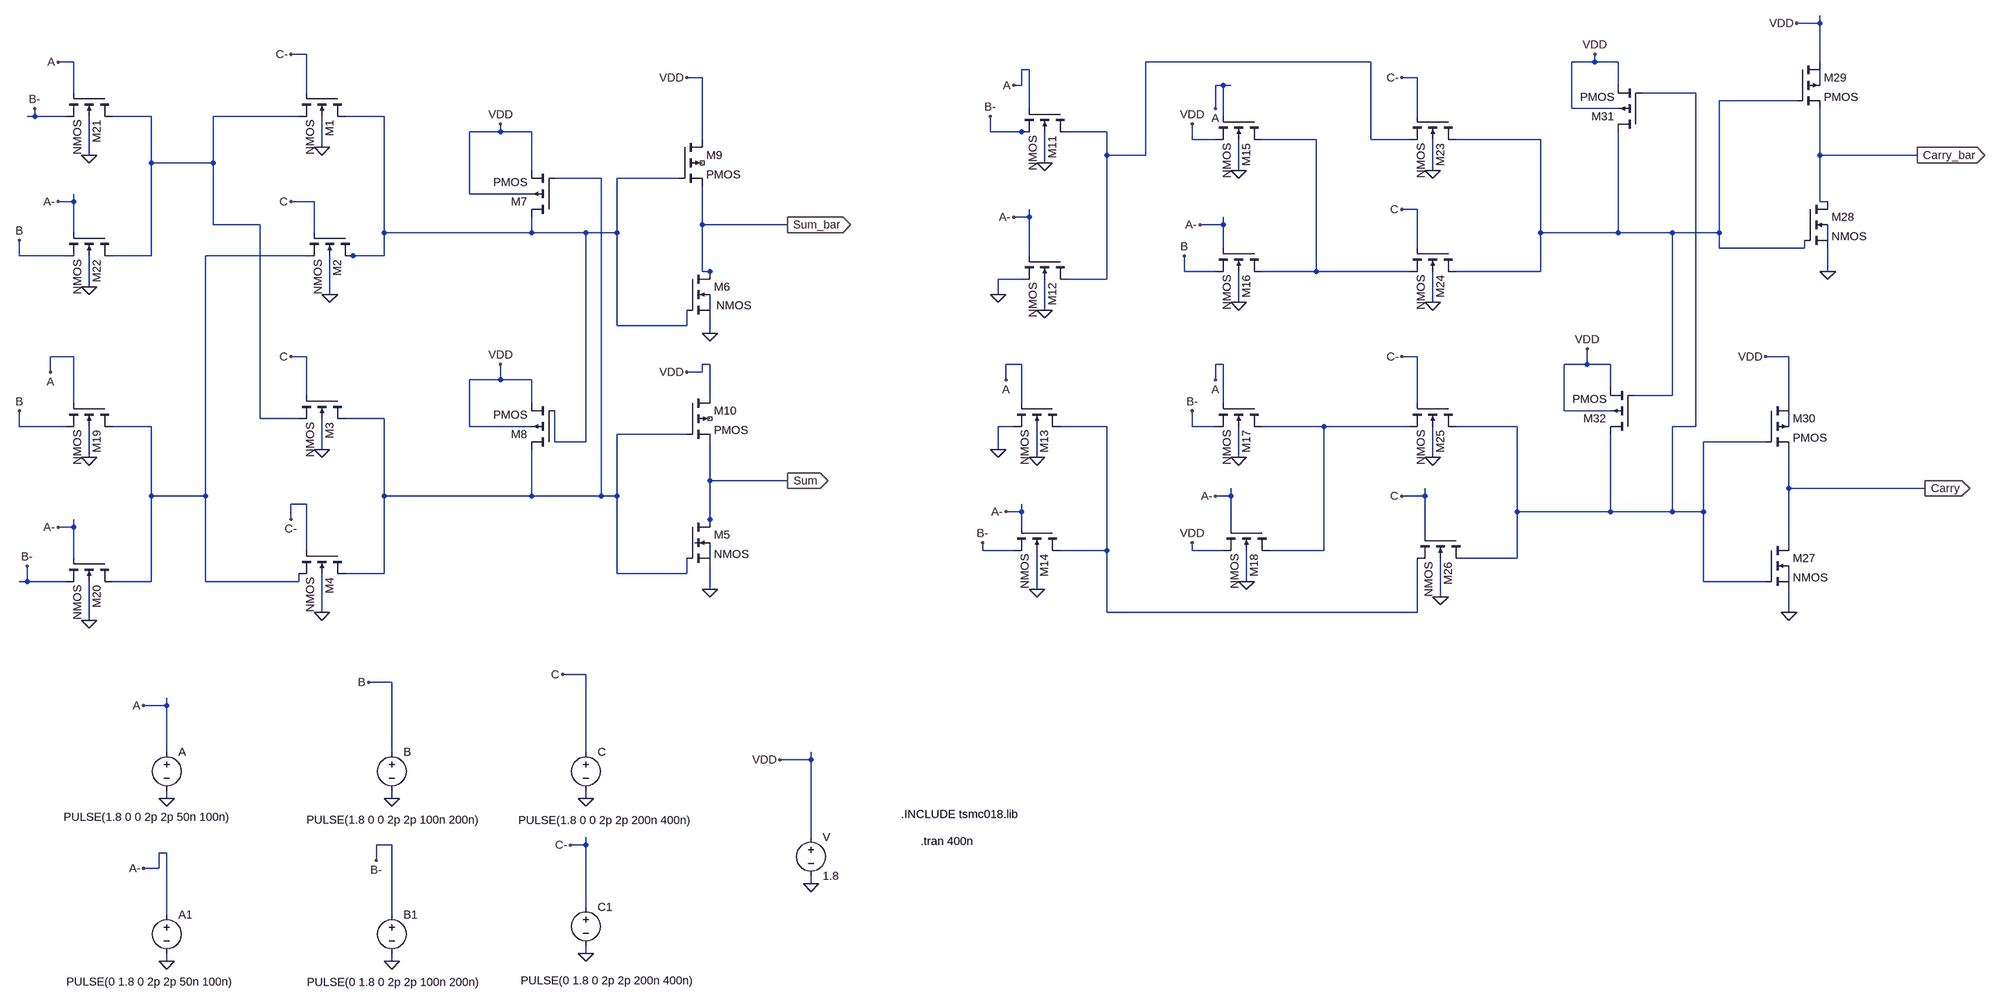
[diagram p0: schematic Pass_Transistor.asc]
Pass_Transistor.asc, the LTspice schematic file:
Version 4.1
SHEET 1 3968 1644
WIRE 3488 -352 3488 -368
WIRE 3488 -352 3440 -352
WIRE 16 -288 -16 -288
WIRE -464 -272 -496 -272
WIRE 2560 -272 2096 -272
WIRE 3024 -272 3024 -288
WIRE 3024 -272 2976 -272
WIRE 3072 -272 3024 -272
WIRE 3488 -272 3488 -352
WIRE 1856 -256 1840 -256
WIRE 832 -240 800 -240
WIRE 2656 -240 2624 -240
WIRE 1840 -224 1840 -256
WIRE 1840 -224 1824 -224
WIRE 2256 -224 2240 -224
WIRE 2272 -224 2256 -224
WIRE 3072 -224 3072 -272
WIRE 3488 -224 3488 -256
WIRE -464 -208 -464 -272
WIRE 16 -208 16 -288
WIRE 3232 -208 3120 -208
WIRE 3440 -192 3280 -192
WIRE 1856 -176 1856 -256
WIRE 2240 -176 2240 -224
WIRE 2976 -176 2976 -272
WIRE 3072 -176 2976 -176
WIRE -544 -160 -544 -176
WIRE -544 -160 -560 -160
WIRE -480 -160 -544 -160
WIRE -304 -160 -384 -160
WIRE 0 -160 -176 -160
WIRE 176 -160 96 -160
WIRE 2256 -160 2256 -224
WIRE 2656 -160 2656 -240
WIRE 416 -128 416 -144
WIRE 416 -128 352 -128
WIRE 480 -128 416 -128
WIRE 1776 -128 1776 -160
WIRE 1840 -128 1776 -128
WIRE 1856 -128 1840 -128
WIRE 2016 -128 1936 -128
WIRE 832 -112 832 -240
WIRE 2192 -112 2192 -144
WIRE 2240 -112 2192 -112
WIRE 2448 -112 2336 -112
WIRE 2560 -112 2560 -272
WIRE 2640 -112 2560 -112
WIRE 2912 -112 2736 -112
WIRE 48 -96 48 -160
WIRE -432 -80 -432 -160
WIRE 2016 -80 2016 -128
WIRE 2096 -80 2096 -272
WIRE 2096 -80 2016 -80
WIRE 3488 -80 3488 -176
WIRE 3792 -80 3488 -80
WIRE -304 -64 -304 -160
WIRE -176 -64 -176 -160
WIRE -176 -64 -304 -64
WIRE 1888 -64 1888 -128
WIRE 480 -48 480 -128
WIRE 2288 -48 2288 -112
WIRE 2688 -48 2688 -112
WIRE 624 -32 528 -32
WIRE 784 -32 656 -32
WIRE 352 0 352 -128
WIRE 480 0 352 0
WIRE -464 16 -464 0
WIRE -464 16 -496 16
WIRE 32 16 -16 16
WIRE 3488 16 3488 -80
WIRE 3504 16 3488 16
WIRE 2656 32 2624 32
WIRE 1856 48 1856 32
WIRE 1856 48 1824 48
WIRE -176 64 -176 -64
WIRE -80 64 -176 64
WIRE 832 64 832 -16
WIRE 1008 64 832 64
WIRE 2256 64 2256 48
WIRE 2256 64 2208 64
WIRE -464 80 -464 16
WIRE 32 80 32 16
WIRE 176 80 176 -160
WIRE 480 80 480 48
WIRE 480 80 176 80
WIRE 592 80 480 80
WIRE 656 80 656 -32
WIRE 656 80 592 80
WIRE 2912 80 2912 -112
WIRE 3072 80 3072 -128
WIRE 3072 80 2912 80
WIRE 3184 80 3072 80
WIRE 3280 80 3280 -192
WIRE 3280 80 3184 80
WIRE 3504 96 3504 64
WIRE 2256 112 2256 64
WIRE 2656 112 2656 32
WIRE 3280 112 3280 80
WIRE 3456 112 3456 96
WIRE 3456 112 3280 112
WIRE -576 128 -576 96
WIRE -480 128 -576 128
WIRE -304 128 -304 -64
WIRE -304 128 -384 128
WIRE 16 128 -192 128
WIRE 112 128 96 128
WIRE 176 128 176 80
WIRE 176 128 112 128
WIRE 1856 128 1856 48
WIRE 832 160 832 64
WIRE 848 160 832 160
WIRE 2176 160 2176 128
WIRE 2240 160 2176 160
WIRE 2448 160 2448 -112
WIRE 2448 160 2336 160
WIRE 2640 160 2448 160
WIRE 2912 160 2912 80
WIRE 2912 160 2736 160
WIRE 3504 160 3504 112
WIRE 848 176 848 160
WIRE 1840 176 1792 176
WIRE 2016 176 2016 -80
WIRE 2016 176 1936 176
WIRE -432 192 -432 128
WIRE 64 208 64 128
WIRE 1792 208 1792 176
WIRE 2288 224 2288 160
WIRE 2688 224 2688 160
WIRE 848 240 848 208
WIRE 1888 240 1888 176
WIRE 656 272 656 80
WIRE 800 272 800 240
WIRE 800 272 656 272
WIRE 848 288 848 256
WIRE -464 336 -512 336
WIRE 16 336 -16 336
WIRE 2656 336 2624 336
WIRE 3424 336 3376 336
WIRE 848 352 832 352
WIRE 1840 352 1808 352
WIRE 2256 352 2240 352
WIRE 3008 352 3008 320
WIRE 3008 352 2960 352
WIRE 3056 352 3008 352
WIRE -512 368 -512 336
WIRE 832 368 832 352
WIRE 832 368 800 368
WIRE 416 384 416 352
WIRE 416 384 352 384
WIRE 480 384 416 384
WIRE 1808 384 1808 352
WIRE 2240 384 2240 352
WIRE 3056 400 3056 352
WIRE 16 416 16 336
WIRE 848 416 848 352
WIRE 3184 416 3184 80
WIRE 3184 416 3104 416
WIRE -464 432 -464 336
WIRE 480 432 480 384
WIRE 1840 432 1840 352
WIRE 2256 432 2256 352
WIRE 2656 432 2656 336
WIRE 3424 432 3424 336
WIRE 2960 448 2960 352
WIRE 3056 448 2960 448
WIRE -80 464 -80 64
WIRE 0 464 -80 464
WIRE 176 464 96 464
WIRE -576 480 -576 448
WIRE -480 480 -576 480
WIRE -304 480 -384 480
WIRE 352 480 352 384
WIRE 480 480 352 480
WIRE 1824 480 1792 480
WIRE 2016 480 1920 480
WIRE 2192 480 2192 448
WIRE 2240 480 2192 480
WIRE 2464 480 2336 480
WIRE 2640 480 2464 480
WIRE 2864 480 2736 480
WIRE 3232 480 3232 -208
WIRE 3232 480 3184 480
WIRE 3424 480 3424 448
WIRE 800 496 656 496
WIRE 528 512 528 448
WIRE 592 512 592 80
WIRE 592 512 528 512
WIRE 3376 512 3248 512
WIRE 48 528 48 464
WIRE 1792 528 1792 480
WIRE -432 544 -432 480
WIRE 1872 544 1872 480
WIRE 2288 544 2288 480
WIRE 2688 544 2688 480
WIRE 848 592 848 512
WIRE 1008 592 848 592
WIRE 3424 608 3424 528
WIRE 3808 608 3424 608
WIRE -304 624 -304 480
WIRE -192 624 -192 128
WIRE -192 624 -304 624
WIRE 176 624 176 464
WIRE 480 624 480 528
WIRE 480 624 176 624
WIRE 624 624 624 -32
WIRE 624 624 480 624
WIRE 656 624 656 496
WIRE 656 624 624 624
WIRE 2272 624 2272 608
WIRE 2272 624 2240 624
WIRE 2672 624 2672 608
WIRE 2672 624 2624 624
WIRE 16 640 -16 640
WIRE 1840 656 1840 640
WIRE 1840 656 1808 656
WIRE 2864 656 2864 480
WIRE 3056 656 3056 496
WIRE 3056 656 2864 656
WIRE 3184 656 3184 480
WIRE 3184 656 3056 656
WIRE 3248 656 3248 512
WIRE 3248 656 3184 656
WIRE -16 672 -16 640
WIRE 848 672 848 592
WIRE -464 688 -464 672
WIRE -464 688 -496 688
WIRE 848 688 848 672
WIRE 1840 688 1840 656
WIRE 2272 688 2272 624
WIRE 2672 704 2672 624
WIRE 832 720 816 720
WIRE 3424 720 3424 608
WIRE 16 736 16 640
WIRE 1760 736 1760 720
WIRE 1824 736 1760 736
WIRE 2016 736 2016 480
WIRE 2016 736 1920 736
WIRE 2192 736 2192 720
WIRE 2256 736 2192 736
WIRE 2464 736 2464 480
WIRE 2464 736 2352 736
WIRE -464 752 -464 688
WIRE 848 752 848 720
WIRE 2864 752 2864 656
WIRE 2864 752 2752 752
WIRE 176 784 176 624
WIRE 176 784 96 784
WIRE 656 784 656 624
WIRE 800 784 800 752
WIRE 800 784 656 784
WIRE -560 800 -560 768
WIRE -560 800 -576 800
WIRE -480 800 -560 800
WIRE -304 800 -304 624
WIRE -304 800 -384 800
WIRE -192 800 -192 624
WIRE 0 800 0 784
WIRE 0 800 -192 800
WIRE 2304 800 2304 736
WIRE 3248 800 3248 656
WIRE 3376 800 3248 800
WIRE 3424 800 3424 768
WIRE 848 816 848 768
WIRE 1872 816 1872 736
WIRE 2704 832 2704 752
WIRE 48 864 48 784
WIRE 2016 864 2016 736
WIRE 2656 864 2656 752
WIRE 2656 864 2016 864
WIRE 3424 864 3424 816
WIRE -432 880 -432 800
WIRE 592 992 544 992
WIRE 192 1008 144 1008
WIRE -272 1056 -272 1040
WIRE -272 1056 -320 1056
WIRE -272 1152 -272 1056
WIRE 192 1152 192 1008
WIRE 592 1152 592 992
WIRE 1056 1168 1056 1152
WIRE 1056 1168 992 1168
WIRE -272 1248 -272 1232
WIRE 192 1248 192 1232
WIRE 592 1248 592 1232
WIRE 1056 1328 1056 1168
WIRE 192 1344 160 1344
WIRE 592 1344 592 1328
WIRE 592 1344 560 1344
WIRE -272 1360 -288 1360
WIRE 160 1376 160 1344
WIRE -288 1392 -288 1360
WIRE -288 1392 -320 1392
WIRE 1056 1424 1056 1408
WIRE 592 1472 592 1344
WIRE -272 1488 -272 1360
WIRE 192 1488 192 1344
WIRE 592 1568 592 1552
WIRE -272 1584 -272 1568
WIRE 192 1584 192 1568
FLAG 48 -96 0
FLAG 64 208 0
FLAG 48 528 0
FLAG 48 864 0
FLAG -432 880 0
FLAG -432 192 0
FLAG -432 -80 0
FLAG -432 544 0
FLAG 848 816 0
FLAG 848 288 0
FLAG 1888 -64 0
FLAG 1888 240 0
FLAG 1872 544 0
FLAG 1872 816 0
FLAG 2288 -48 0
FLAG 2288 224 0
FLAG 2288 544 0
FLAG 2304 800 0
FLAG 2688 -48 0
FLAG 2688 224 0
FLAG 2688 544 0
FLAG 2704 832 0
FLAG 3424 864 0
FLAG 3504 160 0
FLAG 1792 208 0
FLAG 1792 528 0
FLAG -272 1248 0
FLAG 192 1248 0
FLAG 592 1248 0
FLAG -272 1584 0
FLAG 192 1584 0
FLAG 592 1568 0
FLAG 1056 1424 0
FLAG 1008 64 Sum_bar
IOPIN 1008 64 Out
FLAG 1008 592 Sum
IOPIN 1008 592 Out
FLAG 3792 -80 Carry_bar
IOPIN 3792 -80 Out
FLAG 3808 608 Carry
IOPIN 3808 608 Out
FLAG 2240 -176 A
FLAG 2240 384 A
FLAG 1824 -224 A
FLAG 1808 384 A
FLAG -512 368 A
FLAG -496 -272 A
FLAG 1824 48 A-
FLAG 1808 656 A-
FLAG 2240 624 A-
FLAG 2208 64 A-
FLAG -320 1392 A-
FLAG -496 688 A-
FLAG -496 16 A-
FLAG -320 1056 A
FLAG -544 -176 B-
FLAG -560 768 B-
FLAG 1760 720 B-
FLAG 1776 -160 B-
FLAG 2192 448 B-
FLAG 160 1376 B-
FLAG -576 96 B
FLAG -576 448 B
FLAG 144 1008 B
FLAG 2176 128 B
FLAG -16 -288 C-
FLAG -16 672 C-
FLAG 560 1344 C-
FLAG 2624 -240 C-
FLAG 2624 336 C-
FLAG -16 16 C
FLAG -16 336 C
FLAG 544 992 C
FLAG 2624 32 C
FLAG 2624 624 C
FLAG 800 -240 VDD
FLAG 800 368 VDD
FLAG 3440 -352 VDD
FLAG 3376 336 VDD
FLAG 992 1168 VDD
FLAG 416 -144 VDD
FLAG 416 352 VDD
FLAG 3024 -288 VDD
FLAG 2192 -144 VDD
FLAG 2192 720 VDD
FLAG 3008 320 VDD
SYMBOL nmos4 -384 432 R90
SYMATTR InstName M19
SYMATTR Value2 l=100 w=10
SYMBOL nmos4 -384 752 R90
SYMATTR InstName M20
SYMATTR Value2 l=100 w=10
SYMBOL nmos4 -384 -208 R90
SYMATTR InstName M21
SYMATTR Value2 l=100 w=10
SYMBOL nmos4 -384 80 R90
SYMATTR InstName M22
SYMATTR Value2 l=100 w=10
SYMBOL nmos4 96 -208 R90
SYMATTR InstName M1
SYMATTR Value2 l=100 w=10
SYMBOL nmos4 112 80 R90
SYMATTR InstName M2
SYMATTR Value2 l=100 w=10
SYMBOL nmos4 96 416 R90
SYMATTR InstName M3
SYMATTR Value2 l=100 w=10
SYMBOL nmos4 96 736 R90
SYMATTR InstName M4
SYMATTR Value2 l=100 w=10
SYMBOL nmos4 800 160 R0
WINDOW 3 61 70 Left 2
SYMATTR InstName M6
SYMATTR Value2 l=100 w=10
SYMBOL pmos4 528 48 R180
SYMATTR InstName M7
SYMATTR Value2 l=100 w=10
SYMBOL pmos4 528 528 R180
SYMATTR InstName M8
SYMATTR Value2 l=100 w=10
SYMBOL nmos4 800 672 R0
SYMATTR InstName M5
SYMATTR Value2 l=100 w=10
SYMBOL pmos4 784 -112 R0
SYMATTR InstName M9
SYMATTR Value2 l=100 w=10
SYMBOL pmos4 800 416 R0
SYMATTR InstName M10
SYMATTR Value2 l=100 w=10
SYMBOL nmos4 1936 -176 R90
SYMATTR InstName M11
SYMATTR Value2 l=100 w=10
SYMBOL nmos4 1936 128 R90
SYMATTR InstName M12
SYMATTR Value2 l=100 w=10
SYMBOL nmos4 1920 432 R90
SYMATTR InstName M13
SYMATTR Value2 l=100 w=10
SYMBOL nmos4 1920 688 R90
SYMATTR InstName M14
SYMATTR Value2 l=100 w=10
SYMBOL nmos4 2336 -160 R90
SYMATTR InstName M15
SYMATTR Value2 l=100 w=10
SYMBOL nmos4 2336 112 R90
SYMATTR InstName M16
SYMATTR Value2 l=100 w=10
SYMBOL nmos4 2336 432 R90
SYMATTR InstName M17
SYMATTR Value2 l=100 w=10
SYMBOL nmos4 2352 688 R90
SYMATTR InstName M18
SYMATTR Value2 l=100 w=10
SYMBOL nmos4 2736 -160 R90
SYMATTR InstName M23
SYMATTR Value2 l=100 w=10
SYMBOL nmos4 2736 112 R90
SYMATTR InstName M24
SYMATTR Value2 l=100 w=10
SYMBOL nmos4 2736 432 R90
SYMATTR InstName M25
SYMATTR Value2 l=100 w=10
SYMBOL nmos4 2752 704 R90
SYMATTR InstName M26
SYMATTR Value2 l=100 w=10
SYMBOL nmos4 3376 720 R0
SYMATTR InstName M27
SYMATTR Value2 l=100 w=10
SYMBOL nmos4 3456 16 R0
SYMATTR InstName M28
SYMATTR Value2 l=100 w=10
SYMBOL pmos4 3440 -272 R0
SYMATTR InstName M29
SYMATTR Value2 l=100 w=10
SYMBOL pmos4 3376 432 R0
SYMATTR InstName M30
SYMATTR Value2 l=100 w=10
SYMBOL pmos4 3120 -128 R180
SYMATTR InstName M31
SYMATTR Value2 l=100 w=10
SYMBOL pmos4 3104 496 R180
SYMATTR InstName M32
SYMBOL voltage -272 1136 R0
WINDOW 3 -213 150 Left 2
WINDOW 123 0 0 Left 0
WINDOW 39 0 0 Left 0
SYMATTR Value PULSE(1.8 0 0 2p 2p 50n 100n)
SYMATTR InstName A
SYMBOL voltage -272 1472 R0
WINDOW 3 -207 154 Left 2
WINDOW 123 0 0 Left 0
WINDOW 39 0 0 Left 0
SYMATTR Value PULSE(0 1.8 0 2p 2p 50n 100n)
SYMATTR InstName A1
SYMBOL voltage 192 1472 R0
WINDOW 3 -175 155 Left 2
WINDOW 123 0 0 Left 0
WINDOW 39 0 0 Left 0
SYMATTR Value PULSE(0 1.8 0 2p 2p 100n 200n)
SYMATTR InstName B1
SYMBOL voltage 592 1136 R0
WINDOW 3 -139 157 Left 2
WINDOW 123 0 0 Left 0
WINDOW 39 0 0 Left 0
SYMATTR Value PULSE(1.8 0 0 2p 2p 200n 400n)
SYMATTR InstName C
SYMBOL voltage 592 1456 R0
WINDOW 3 -134 168 Left 2
WINDOW 123 0 0 Left 0
WINDOW 39 0 0 Left 0
SYMATTR Value PULSE(0 1.8 0 2p 2p 200n 400n)
SYMATTR InstName C1
SYMBOL voltage 1056 1312 R0
WINDOW 123 0 0 Left 0
WINDOW 39 0 0 Left 0
SYMATTR InstName V
SYMATTR Value 1.8
SYMBOL voltage 192 1136 R0
WINDOW 3 -176 156 Left 2
WINDOW 123 0 0 Left 0
WINDOW 39 0 0 Left 0
SYMATTR Value PULSE(1.8 0 0 2p 2p 100n 200n)
SYMATTR InstName B
TEXT 1592 1280 Left 2 !.INCLUDE tsmc018.lib
TEXT 1632 1336 Left 2 !.tran 400n

The netlist it stands for:
* Pass_Transistor.asc
M19 N010 A B 0 NMOS l=100 w=10
M20 N010 A- B- 0 NMOS l=100 w=10
M21 N005 A B- 0 NMOS l=100 w=10
M22 N005 A- B 0 NMOS l=100 w=10
M1 N006 C- N005 0 NMOS l=100 w=10
M2 N006 C N010 0 NMOS l=100 w=10
M3 N008 C N005 0 NMOS l=100 w=10
M4 N008 C- N010 0 NMOS l=100 w=10
M6 Sum_bar N006 0 N011 NMOS l=100 w=10
M7 N006 N008 VDD VDD PMOS l=100 w=10
M8 N008 N006 VDD VDD PMOS l=100 w=10
M5 Sum N008 0 N016 NMOS l=100 w=10
M9 VDD N006 Sum_bar NC_01 PMOS l=100 w=10
M10 VDD N008 Sum NC_02 PMOS l=100 w=10
M11 N001 A B- 0 NMOS l=100 w=10
M12 N001 A- 0 0 NMOS l=100 w=10
M13 N012 A 0 0 NMOS l=100 w=10
M14 N012 A- B- 0 NMOS l=100 w=10
M15 N007 A VDD 0 NMOS l=100 w=10
M16 N007 A- B 0 NMOS l=100 w=10
M17 N013 A B- 0 NMOS l=100 w=10
M18 N013 A- VDD 0 NMOS l=100 w=10
M23 N004 C- N001 0 NMOS l=100 w=10
M24 N004 C N007 0 NMOS l=100 w=10
M25 N003 C- N013 0 NMOS l=100 w=10
M26 N003 C N012 0 NMOS l=100 w=10
M27 Carry N003 0 N017 NMOS l=100 w=10
M28 Carry_bar N004 0 N009 NMOS l=100 w=10
M29 VDD N004 Carry_bar N002 PMOS l=100 w=10
M30 VDD N003 Carry N014 PMOS l=100 w=10
M31 N004 N003 VDD VDD PMOS l=100 w=10
M32 N003 N004 VDD VDD PMOS
V§A A 0 PULSE(1.8 0 0 2p 2p 50n 100n)
V§A1 A- 0 PULSE(0 1.8 0 2p 2p 50n 100n)
V§B1 B- 0 PULSE(0 1.8 0 2p 2p 100n 200n)
V§C C 0 PULSE(1.8 0 0 2p 2p 200n 400n)
V§C1 C- 0 PULSE(0 1.8 0 2p 2p 200n 400n)
V VDD 0 1.8
V§B B 0 PULSE(1.8 0 0 2p 2p 100n 200n)
.model NMOS NMOS
.model PMOS PMOS
.lib standard.mos
.INCLUDE tsmc018.lib
.tran 400n
.backanno
.end